# Altium schematic sheet PAGE2.schdoc: Active Tag 433.92 MHz Receiver
size B; DocumentNumber: Crdit Card Size Tag; Revision: 37; SheetNumber: 2; SheetTotal: 2
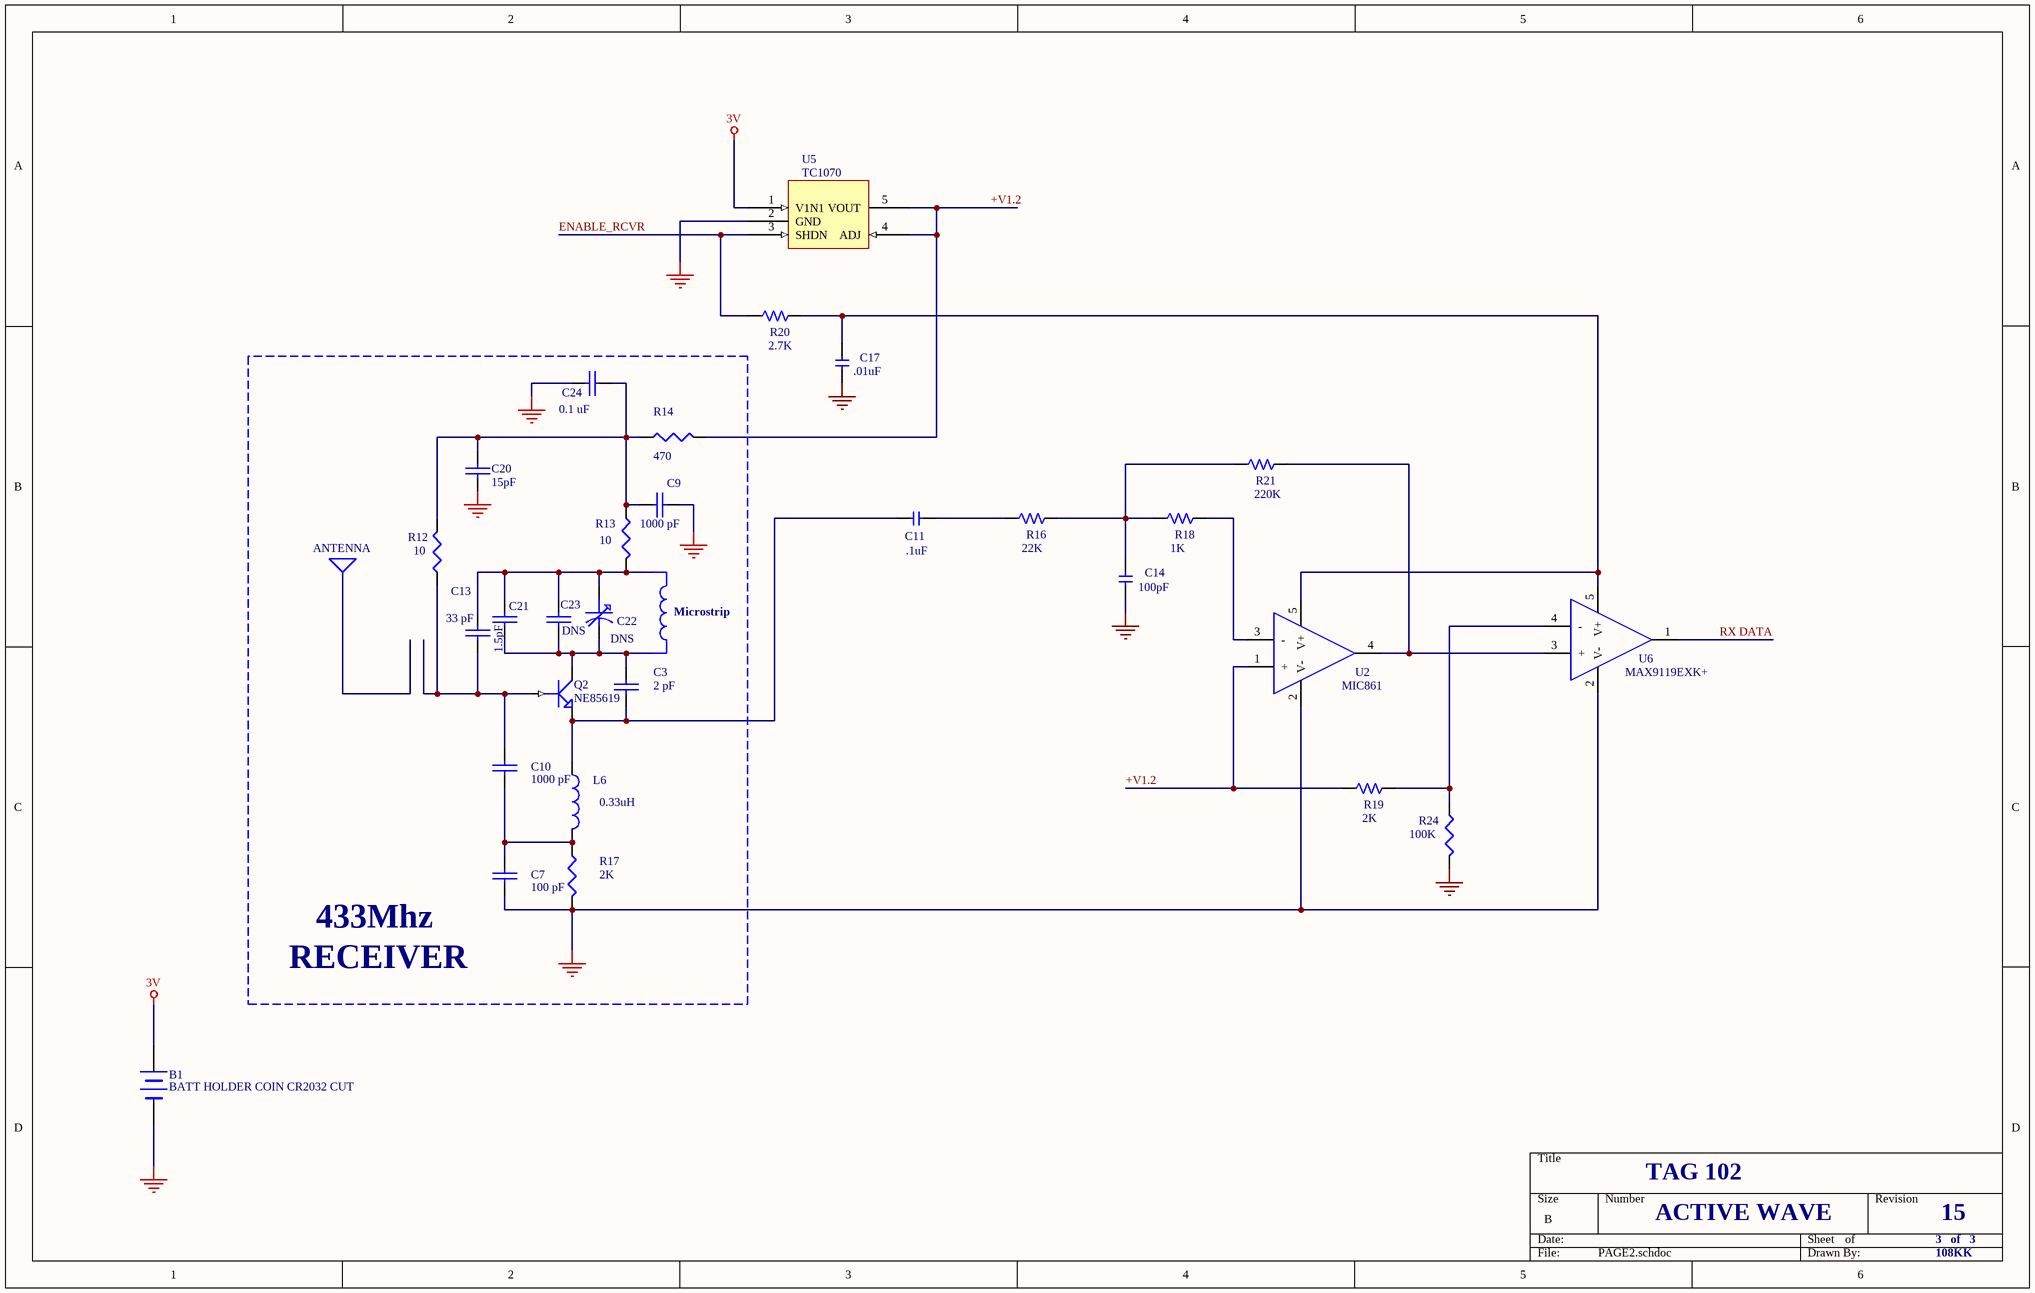
[diagram p0: PAGE2.schdoc]

## Parts
B1  BATT HOLDER COIN CR2032 CUT  [BATT HOLDER1]
C3  2 pF  [0603]
C7  100 pF  [0603]
C9  1000 pF  [0603]
C10  1000 pF  [0603]
C11  .1uF  [0603]
C13  33 pF  [0603]
C14  100pF  [0603]
C17  .01uF  [0603]
C20  15pF  [0603]
C21  1.5pF  [0603]
C22  DNS  [0603]
C23  DNS  [0603]
C24  0.1 uF  [0603]
L6  0.33uH  [0603]
Q2  NE85619  [3 PIN ULTRA SUPER MINI MOLD]
R12  10  [0603]
R13  10  [0603]
R14  470  [0603]
R16  22K  [0603]
R17  2K  [0603]
R18  1K  [0603]
R19  2K  [0603]
R20  2.7K  [0603]
R21  220K  [0603]
R24  100K  [0603]
U2  MIC861
U5  TC1070  [SOT23-5A]
U6  MAX9119EXK+  [SC70]

## Nets
3V: B1.2(+) U5.1(V1N1)
GND: B1.1(-) C7.2 C9.2 C14.1 C17.1 C20.1 C24.1 R17.2 R24.2 U2.2(V-) U5.2(GND) U6.2(V-)
+V1.2: R14.2 R19.1 U2.1(+) U5.4(ADJ) U5.5(VOUT)
ENABLE_RCVR: R20.1 U5.3(SHDN)
RX DATA: U6.1(OUT)
NetC3_1: C3.1 C21.2 C22.2 C23.2 Q2.C
NetC3_2: C3.2 C11.1 L6.1 Q2.E
NetC7_1: C7.1 C10.2 L6.2 R17.1
NetC9_1: C9.1 C20.2 C24.2 R12.2 R13.1 R14.1
NetC10_1: C10.1 C13.1 Q2.B R12.1
NetC11_2: C11.2 R16.1
NetC13_2: C13.2 C21.1 C22.1 C23.1 R13.2
NetC14_2: C14.2 R16.2 R18.1 R21.1
NetC17_2: C17.2 R20.2 U2.5(V+) U6.5(V+)
NetR18_2: R18.2 U2.3(-)
NetR19_2: R19.2 R24.1 U6.4(-)
NetR21_2: R21.2 U2.4(OUT) U6.3(+)

## Notes on the sheet
- ANTENNA
- Microstrip
- RECEIVER
- 433Mhz
- TAG 102
- ACTIVE WAVE
- 3   of   3
- 15
- 108KK

## Library data of the parts
B1 = BATTERY
C3 C7 C9 C10 C13 C20 C21 C23 C24 = CAP: Capacitor
C11 C14 C17 = C: Text Field1: 10; Text Field2: 20
C22 = CAPACITOR VAR: Text Field1: 20; Text Field2: 20
L6 = INDUCTOR: Text Field1: 20; Text Field2: 40
Q2 = NPN1: NPN Transistor
R12-R14 R24 = R: Text Field1: 20; Text Field2: 30
R16 R18-R21 = R: Text Field1: 20; Text Field2: 20
R17 = RESISTOR: Text Field1: 20; Text Field2: 30
U2 = OPAMP MIC861
U5 = TC1070-2: Text Field1: 60; Text Field2: 50
U6 = COMPARATOR MAX9117